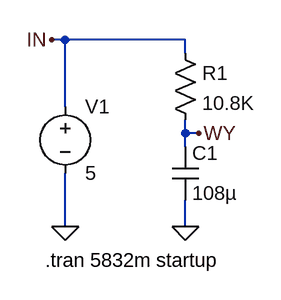
[diagram p0: schematic RCukladlista4.asc]
RCukladlista4.asc, the LTspice schematic file:
Version 4.1
SHEET 1 880 680
WIRE 112 64 96 64
WIRE 256 64 112 64
WIRE 256 80 256 64
WIRE 112 144 112 64
WIRE 256 176 256 160
WIRE 272 176 256 176
WIRE 256 192 256 176
WIRE 112 288 112 224
WIRE 256 288 256 256
FLAG 256 288 0
FLAG 112 288 0
FLAG 96 64 IN
FLAG 272 176 WY
SYMBOL voltage 112 128 R0
WINDOW 123 0 0 Left 0
WINDOW 39 0 0 Left 0
SYMATTR InstName V1
SYMATTR Value 5
SYMBOL res 240 64 R0
SYMATTR InstName R1
SYMATTR Value 10.8K
SYMBOL cap 240 192 R0
SYMATTR InstName C1
SYMATTR Value 108µ
TEXT 88 328 Left 2 !.tran 5832m startup

The netlist it stands for:
* RCukladlista4.asc
V1 IN 0 5
R1 IN WY 10.8K
C1 WY 0 108µ
.tran 5832m startup
.backanno
.end